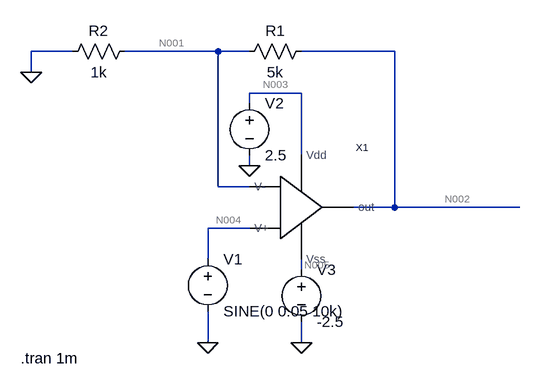
[diagram p0: schematic Draft4.asc]
Draft4.asc, the LTspice schematic file:
Version 4
SHEET 1 880 680
WIRE -128 -96 -192 -96
WIRE 96 -96 -48 -96
WIRE 144 -96 96 -96
WIRE 368 -96 224 -96
WIRE -192 -64 -192 -96
WIRE 224 -32 144 -32
WIRE 144 -16 144 -32
WIRE 224 64 224 -32
WIRE 144 80 144 64
WIRE 96 112 96 -96
WIRE 144 112 96 112
WIRE 368 144 368 -96
WIRE 368 144 304 144
WIRE 560 144 368 144
WIRE 144 176 80 176
WIRE 80 224 80 176
WIRE 224 240 224 224
WIRE 80 352 80 304
WIRE 224 352 224 320
FLAG 80 352 0
FLAG 224 352 0
FLAG 144 80 0
FLAG -192 -64 0
SYMBOL res 240 -112 R90
WINDOW 0 0 56 VBottom 2
WINDOW 3 32 56 VTop 2
SYMATTR InstName R1
SYMATTR Value 5k
SYMBOL voltage 80 208 R0
WINDOW 123 0 0 Left 0
WINDOW 39 0 0 Left 0
SYMATTR InstName V1
SYMATTR Value SINE(0 0.05 10k)
SYMBOL voltage 144 -32 R0
WINDOW 123 0 0 Left 0
WINDOW 39 0 0 Left 0
SYMATTR InstName V2
SYMATTR Value 2.5
SYMBOL voltage 224 224 R0
WINDOW 123 0 0 Left 0
WINDOW 39 0 0 Left 0
SYMATTR InstName V3
SYMATTR Value -2.5
SYMBOL res -32 -112 R90
WINDOW 0 0 56 VBottom 2
WINDOW 3 32 56 VTop 2
SYMATTR InstName R2
SYMATTR Value 1k
SYMBOL OPAMP 112 144 R0
SYMATTR InstName X1
TEXT -208 376 Left 2 !.tran 1m

The netlist it stands for:
* Draft4.asc
R1 N002 N001 5k
V1 N004 0 SINE(0 0.05 10k)
V2 N003 0 2.5
V3 N005 0 -2.5
R2 N001 0 1k
XX1 N003 N005 N001 N004 N002 OPAMP  ; pins Vdd Vss V- V+ out
.tran 1m
.backanno
.end

* Results of the author's LTspice run, read from the files saved beside the schematic
* Operating Point, zero values left out:
*   V(n002) = 285.5 µV
*   V(n001) = 47.58 µV
*   V(n003) = 2.5 V
*   V(n005) = -2.5 V
*   I(R1) = 47.58 nA
*   I(R2) = 47.58 nA
*   I(V2) = -188.5 µA
*   I(V3) = 188.4 µA
*   Ix(x1:VDD) = 188.5 µA
*   Ix(x1:VSS) = -188.4 µA
*   Ix(x1:OUT) = -47.58 nA
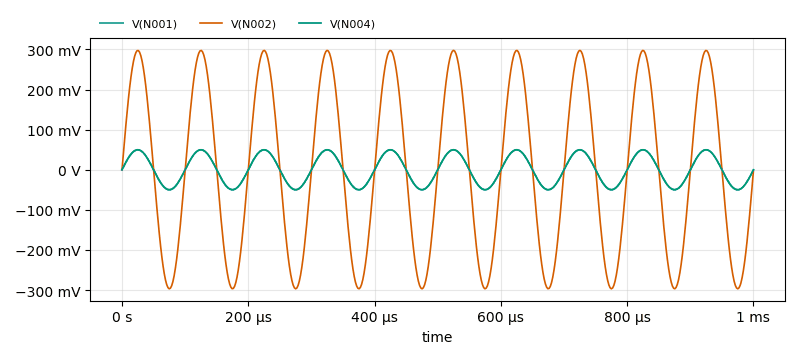
[diagram p1: Transient Analysis of Draft4.asc, plotted from the saved traces]
* Transient Analysis, 1 run:
*   V(N001): min -49.47 mV, max 49.63 mV, average 65.42 µV, rms 35.04 mV, last -450.2 µV
*   V(N002): min -296.8 mV, max 297.8 mV, average 392.5 µV, rms 210.2 mV, last -2.701 mV
*   V(N004): min -50 mV, max 50 mV, average -40 nV, rms 35.36 mV, last 0 V